# Altium schematic sheet power_curr_mon.SchDoc: =GlobalProjectName
size 209 x 297 mm; SheetNumber: 5; SheetTotal: 6; PageSetup: Record=PageOptions|CenterHorizontal=True|CenterVertical=True|PrintScale=1.00|XCorrection=1.00|YCorrection=1.00|PrintKind=1|BorderSize=5000000|LeftOffset=0|BottomOffset=0|Orientation=2|PaperLength=1000|PaperWidth=1000|Scale=100|PaperSource=15|PrintQuality=1200|MediaType=1|DitherType=10|PaperKind=A3|PrintScaleMode=1; Weight: -; ScaleFactor: -
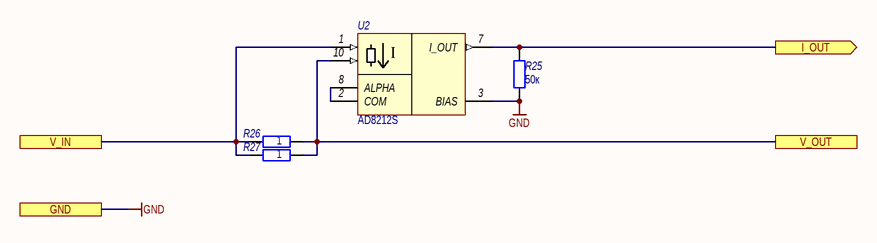
[diagram p0: power_curr_mon.SchDoc]

## Parts
R25  50к  [SMD_0805]
R26  1  [SMD_1206]
R27  1  [SMD_1206]
U2  AD8212S  [FlatPack-10_MSOP-8]

## Ports
GND, I_OUT (out), V_IN, V_OUT

## Nets
GND: R25.1 U2.3(BIAS) ; port GND
I_OUT: R25.2 U2.7(I_OUT) ; port I_OUT
V_IN: R26.1 R27.1 U2.1(V+) ; port V_IN
V_OUT: R26.2 R27.2 U2.10(V_SENSE) ; port V_OUT
NetU2_2: U2.2(COM) U2.8(ALPHA)

## Notes on the sheet
- Подп. и дата
- Инв. № дубл.
- Взам. инв. №
- Инв. № подл.
- Изм.
- Лист
- № докум.
- Подп.
- Дата
- Форма 2а ГОСТ 2.104-2006
- Копировал
- Формат А4
- (in symbol AD8212S) I

## Library data of the parts
R25-R27 = Resistor: Наименование: Резистор; Назначение: SMD-резистор; Потребление, Вт: 0,001
  R25: Value: 50к
  R26 R27: Value: 1
U2 = AD8212S: Назначение: Токовый датчик; Наименование: AD8212S